# Altium project PCB_Project1.PrjPCB
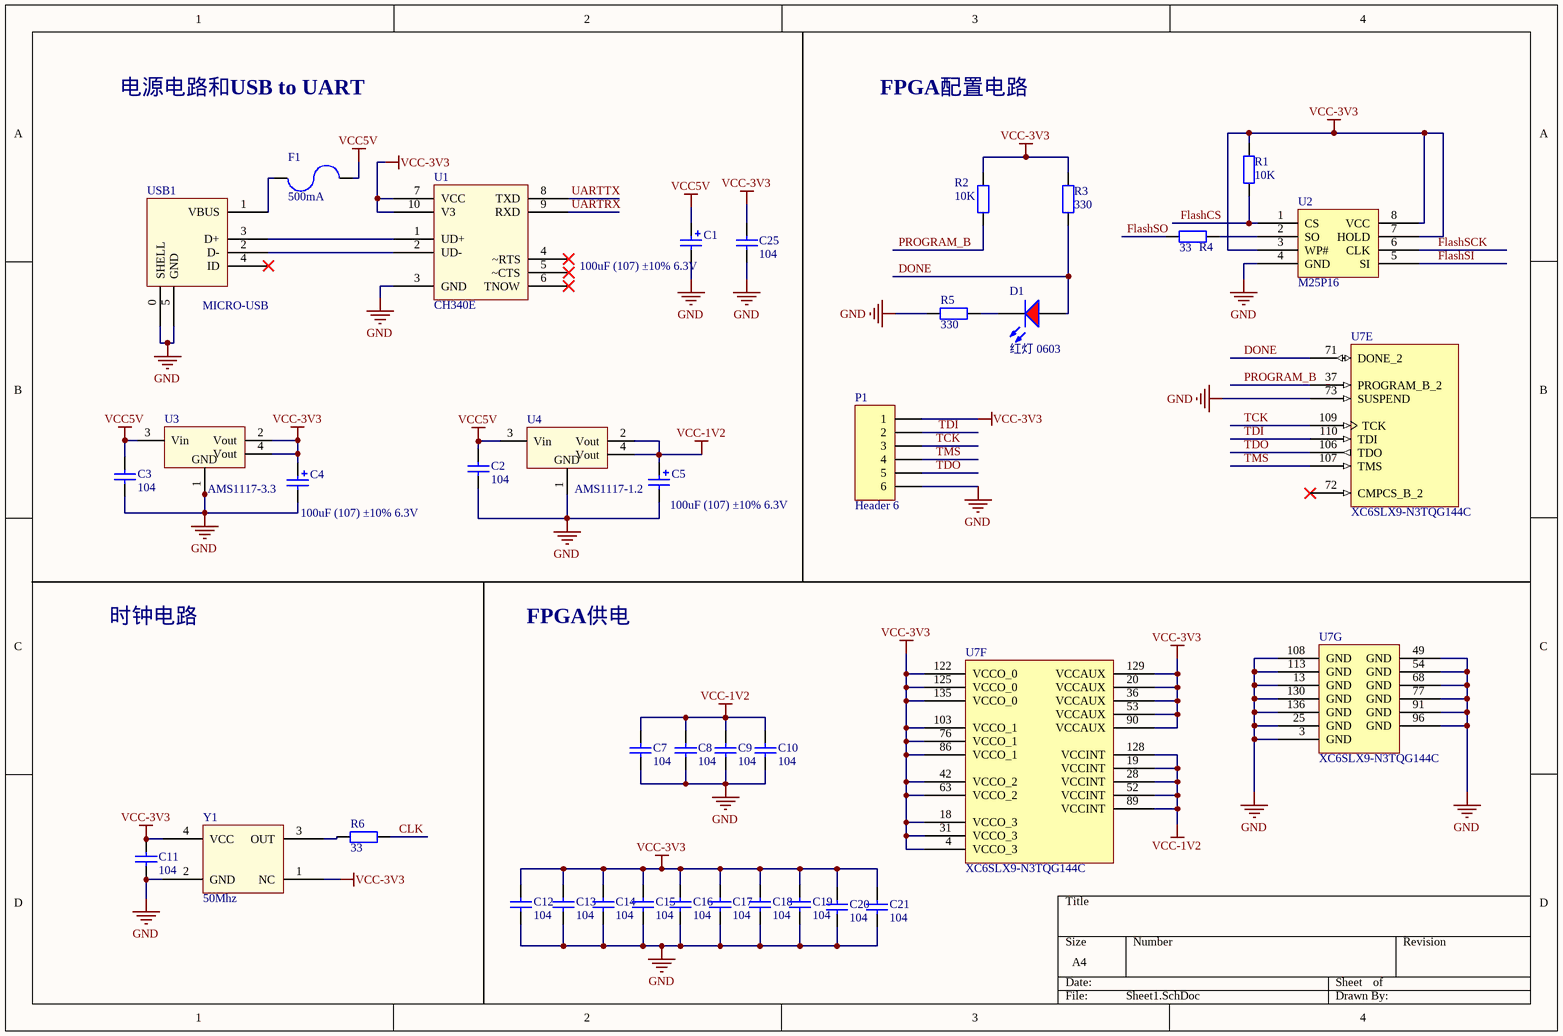
[diagram p0: Sheet1.SchDoc]
3 sheets, 53 parts. Net scope: global (net labels, ports and power ports of the same name join across sheets).
Board file: PCB1.PcbDoc
Sheets:
  Sheet1.SchDoc
  Sheet2.SchDoc
  Sheet4.SchDoc

## Sheet Sheet1.SchDoc
size A4

### Parts
C1  100uF (107) ±10% 6.3V  [CASE-B_3528]
C2  104  [0603_C]
C3  104  [0603_C]
C4  100uF (107) ±10% 6.3V  [CASE-B_3528]
C5  100uF (107) ±10% 6.3V  [CASE-B_3528]
C7  104  [0603_C]
C8  104  [0603_C]
C9  104  [0603_C]
C10  104  [0603_C]
C11  104  [0603_C]
C12  104  [0603_C]
C13  104  [0603_C]
C14  104  [0603_C]
C15  104  [0603_C]
C16  104  [0603_C]
C17  104  [0603_C]
C18  104  [0603_C]
C19  104  [0603_C]
C20  104  [0603_C]
C21  104  [0603_C]
C25  104  [0603_C]
D1  红灯 0603  [0603_LED_S1]
F1  500mA  [PTC[0805]]
P1  Header 6  [HDR1X6]
R1  10K  [0603_R]
R2  10K  [0603_R]
R3  330  [0603_R]
R4  33  [0603_R]
R5  330  [0603_R]
R6  33  [0603_R]
U1  CH340E  [MSOP10]
U2  M25P16  [SO-8]
U3  AMS1117-3.3  [SOT-223(AMS1117-3.3)]
U4  AMS1117-1.2  [SOT-223(AMS1117-3.3)]
U7  XC6SLX9-N3TQG144C  [TQG144_N]  (parts E,F,G of 7)
USB1  MICRO-USB  [MICRO-USB]
Y1  50Mhz  [XTAL5032]

### Nets
GND: C1.2 C2.1 C3.1 C4.2 C5.2 C7.1 C8.1 C9.1 C10.1 C11.1 C12.1 C13.1 C14.1 C15.1 C16.1 C17.1 C18.1 C19.1 C20.1 C21.1 C25.1 P1.6 R5.2 U1.3(GND) U2.4(GND) U3.1(GND) U4.1(GND) U7.3(GND) U7.13(GND) U7.25(GND) U7.49(GND) U7.54(GND) U7.68(GND) U7.73(SUSPEND) U7.77(GND) U7.91(GND) U7.96(GND) U7.108(GND) U7.113(GND) U7.130(GND) U7.136(GND) USB1.0(SHELL) USB1.5(GND) Y1.2(GND)
VCC5V: C1.1 C2.2 C3.2 F1.1 U3.3(Vin) U4.3(Vin)
VCC-1V2: C5.1 C7.2 C8.2 C9.2 C10.2 U4.2(Vout) U4.4(Vout) U7.19(VCCINT) U7.28(VCCINT) U7.52(VCCINT) U7.89(VCCINT) U7.128(VCCINT)
VCC-3V3: C4.1 C11.2 C12.2 C13.2 C14.2 C15.2 C16.2 C17.2 C18.2 C19.2 C20.2 C21.2 C25.2 P1.1 R1.2 R2.2 R3.2 U1.7(VCC) U1.10(V3) U2.3(WP#) U2.7(HOLD) U2.8(VCC) U3.2(Vout) U3.4(Vout) U7.4(VCCO_3) U7.18(VCCO_3) U7.20(VCCAUX) U7.31(VCCO_3) U7.36(VCCAUX) U7.42(VCCO_2) U7.53(VCCAUX) U7.63(VCCO_2) U7.76(VCCO_1) U7.86(VCCO_1) U7.90(VCCAUX) U7.103(VCCO_1) U7.122(VCCO_0) U7.125(VCCO_0) U7.129(VCCAUX) U7.135(VCCO_0) Y1.1(NC) Y1.4(VCC)
CLK: R6.1
DONE: D1.A R3.1 U7.71(DONE_2)
FlashCS: R1.1 U2.1(CS)
FlashSCK: U2.6(CLK)
FlashSI: U2.5(SI)
FlashSO: R4.2
PROGRAM_B: R2.1 U7.37(PROGRAM_B_2)
TCK: P1.3 U7.109(TCK)
TDI: P1.2 U7.110(TDI)
TDO: P1.5 U7.106(TDO)
TMS: P1.4 U7.107(TMS)
UARTRX: U1.9(RXD)
UARTTX: U1.8(TXD)
NetD1_K: D1.K R5.1
NetF1_2: F1.2 USB1.1(VBUS)
NetR4_1: R4.1 U2.2(SO)
NetR6_2: R6.2 Y1.3(OUT)
NetU1_1: U1.1(UD+) USB1.3(D+)
NetU1_2: U1.2(UD-) USB1.2(D-)

Not connected (* = marked no-connect by the designer): U1 4(~RTS)* 5(~CTS)* 6(TNOW)*; U7 72(CMPCS_B_2)*; USB1 4(ID)*

### Notes on the sheet
- 电源电路和USB to UART
- FPGA配置电路
- 时钟电路
- FPGA供电

### Library data of the parts
C1 C4 C5 = 3528 100uF (107) 10% 6.3V: 钽电容; ComponentLink1Description: 供应商链接; ComponentLink1URL: http://www.szlcsc.com/product/details_16815.html; Package: 3528; Supplier: LC; SuppliersPartNumber: C16133
C2 C3 C7-C21 C25 = 0603 30pF (300) 5% 50V: 贴片电容; ComponentLink1Description: 供应商链接; ComponentLink1URL: http://www.szlcsc.com/product/details_23122.html; Package: 0603; Supplier: LC; SuppliersPartNumber: C22397
D1 = 0603 红灯: 发光二极管; ComponentLink1Description: 供应商链接; ComponentLink1URL: http://www.szlcsc.com/product/details_2659.html; Package: 0603; Supplier: LC; SuppliersPartNumber: C2286
F1 = PTC
P1 = Header 6: Header, 6-Pin; LatestRevisionDate: 17-Jul-2002; LatestRevisionNote: Re-released for DXP Platform.; Publisher: Altium Limited
R1-R6 = 0603 9.1KΩ (9101) 1%: 贴片电阻; ComponentLink1Description: 供应商链接; ComponentLink1URL: http://www.szlcsc.com/product/details_23987.html; Package: 0603; Supplier: LC; SuppliersPartNumber: C23260
U2 = W25Q64
U4 = AMS1117-3.3
U7 = XC6SLX9-N3TQG144C: Spartan-6 LX 1.2V FPGA, 102 User I/Os, 144-Pin TQFP (0.5mm Pitch), Speed Grade 3N, Commercial Grade, Pb-Free; Published: 24-Aug-2010; DatasheetVersion: ver1.6, Nov-2010; PackageVersion: ver1.2, Jun-2004; PackageReference: TQG144; Publisher: Altium Limited; PackageDescription: 144-Pin Thin Quad Flat Pack (TQG144) - Pb-Free; Code_JEDEC: MS-026-BFB; ComponentLink1Description: Manufacturer Link; ComponentLink1URL: http://www.xilinx.com; ComponentLink2Description: Spartan-6 Datasheet; ComponentLink2URL: http://www.xilinx.com/support/documentation/data_sheets/ds160.pdf; ComponentLink3Description: Spartan-6 Documents; ComponentLink3URL: http://www.xilinx.com/support/documentation/spartan-6.htm; ComponentLink4Description: Xilinx.com Home; ComponentLink4URL: http://www.xilinx.com
Y1 = 有源晶振

## Sheet Sheet2.SchDoc
size A4
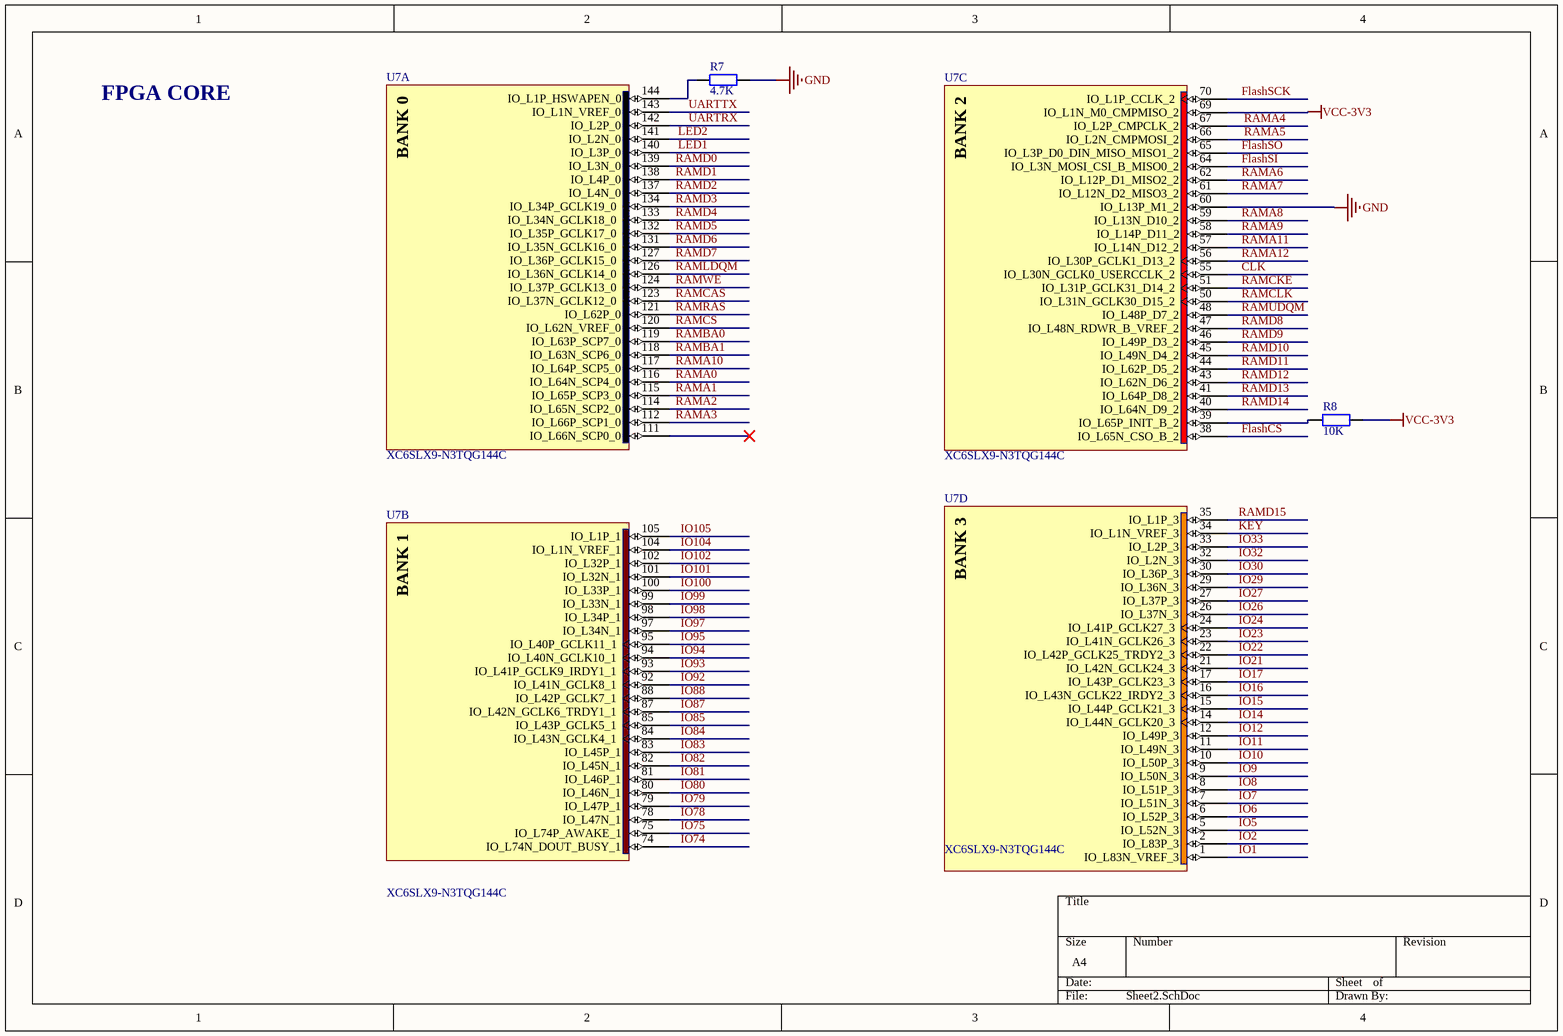
[diagram p1: Sheet2.SchDoc]

### Parts
R7  4.7K  [0603_R]
R8  10K  [0603_R]
U7  XC6SLX9-N3TQG144C  [TQG144_N]  (parts A,B,C,D of 7)

### Nets
GND: R7.2 U7.60(IO_L13P_M1_2)
VCC-3V3: R8.1 U7.69(IO_L1N_M0_CMPMISO_2)
CLK: U7.55(IO_L30N_GCLK0_USERCCLK_2)
FlashCS: U7.38(IO_L65N_CSO_B_2)
FlashSCK: U7.70(IO_L1P_CCLK_2)
FlashSI: U7.64(IO_L3N_MOSI_CSI_B_MISO0_2)
FlashSO: U7.65(IO_L3P_D0_DIN_MISO_MISO1_2)
IO1: U7.1(IO_L83N_VREF_3)
IO2: U7.2(IO_L83P_3)
IO5: U7.5(IO_L52N_3)
IO6: U7.6(IO_L52P_3)
IO7: U7.7(IO_L51N_3)
IO8: U7.8(IO_L51P_3)
IO9: U7.9(IO_L50N_3)
IO10: U7.10(IO_L50P_3)
IO11: U7.11(IO_L49N_3)
IO12: U7.12(IO_L49P_3)
IO14: U7.14(IO_L44N_GCLK20_3)
IO15: U7.15(IO_L44P_GCLK21_3)
IO16: U7.16(IO_L43N_GCLK22_IRDY2_3)
IO17: U7.17(IO_L43P_GCLK23_3)
IO21: U7.21(IO_L42N_GCLK24_3)
IO22: U7.22(IO_L42P_GCLK25_TRDY2_3)
IO23: U7.23(IO_L41N_GCLK26_3)
IO24: U7.24(IO_L41P_GCLK27_3)
IO26: U7.26(IO_L37N_3)
IO27: U7.27(IO_L37P_3)
IO29: U7.29(IO_L36N_3)
IO30: U7.30(IO_L36P_3)
IO32: U7.32(IO_L2N_3)
IO33: U7.33(IO_L2P_3)
IO74: U7.74(IO_L74N_DOUT_BUSY_1)
IO75: U7.75(IO_L74P_AWAKE_1)
IO78: U7.78(IO_L47N_1)
IO79: U7.79(IO_L47P_1)
IO80: U7.80(IO_L46N_1)
IO81: U7.81(IO_L46P_1)
IO82: U7.82(IO_L45N_1)
IO83: U7.83(IO_L45P_1)
IO84: U7.84(IO_L43N_GCLK4_1)
IO85: U7.85(IO_L43P_GCLK5_1)
IO87: U7.87(IO_L42N_GCLK6_TRDY1_1)
IO88: U7.88(IO_L42P_GCLK7_1)
IO92: U7.92(IO_L41N_GCLK8_1)
IO93: U7.93(IO_L41P_GCLK9_IRDY1_1)
IO94: U7.94(IO_L40N_GCLK10_1)
IO95: U7.95(IO_L40P_GCLK11_1)
IO97: U7.97(IO_L34N_1)
IO98: U7.98(IO_L34P_1)
IO99: U7.99(IO_L33N_1)
IO100: U7.100(IO_L33P_1)
IO101: U7.101(IO_L32N_1)
IO102: U7.102(IO_L32P_1)
IO104: U7.104(IO_L1N_VREF_1)
IO105: U7.105(IO_L1P_1)
KEY: U7.34(IO_L1N_VREF_3)
LED1: U7.140(IO_L3P_0)
LED2: U7.141(IO_L2N_0)
RAMA0: U7.116(IO_L64N_SCP4_0)
RAMA1: U7.115(IO_L65P_SCP3_0)
RAMA2: U7.114(IO_L65N_SCP2_0)
RAMA3: U7.112(IO_L66P_SCP1_0)
RAMA4: U7.67(IO_L2P_CMPCLK_2)
RAMA5: U7.66(IO_L2N_CMPMOSI_2)
RAMA6: U7.62(IO_L12P_D1_MISO2_2)
RAMA7: U7.61(IO_L12N_D2_MISO3_2)
RAMA8: U7.59(IO_L13N_D10_2)
RAMA9: U7.58(IO_L14P_D11_2)
RAMA10: U7.117(IO_L64P_SCP5_0)
RAMA11: U7.57(IO_L14N_D12_2)
RAMA12: U7.56(IO_L30P_GCLK1_D13_2)
RAMBA0: U7.119(IO_L63P_SCP7_0)
RAMBA1: U7.118(IO_L63N_SCP6_0)
RAMCAS: U7.123(IO_L37N_GCLK12_0)
RAMCKE: U7.51(IO_L31P_GCLK31_D14_2)
RAMCLK: U7.50(IO_L31N_GCLK30_D15_2)
RAMCS: U7.120(IO_L62N_VREF_0)
RAMD0: U7.139(IO_L3N_0)
RAMD1: U7.138(IO_L4P_0)
RAMD2: U7.137(IO_L4N_0)
RAMD3: U7.134(IO_L34P_GCLK19_0)
RAMD4: U7.133(IO_L34N_GCLK18_0)
RAMD5: U7.132(IO_L35P_GCLK17_0)
RAMD6: U7.131(IO_L35N_GCLK16_0)
RAMD7: U7.127(IO_L36P_GCLK15_0)
RAMD8: U7.47(IO_L48N_RDWR_B_VREF_2)
RAMD9: U7.46(IO_L49P_D3_2)
RAMD10: U7.45(IO_L49N_D4_2)
RAMD11: U7.44(IO_L62P_D5_2)
RAMD12: U7.43(IO_L62N_D6_2)
RAMD13: U7.41(IO_L64P_D8_2)
RAMD14: U7.40(IO_L64N_D9_2)
RAMD15: U7.35(IO_L1P_3)
RAMLDQM: U7.126(IO_L36N_GCLK14_0)
RAMRAS: U7.121(IO_L62P_0)
RAMUDQM: U7.48(IO_L48P_D7_2)
RAMWE: U7.124(IO_L37P_GCLK13_0)
UARTRX: U7.142(IO_L2P_0)
UARTTX: U7.143(IO_L1N_VREF_0)
NetR7_1: R7.1 U7.144(IO_L1P_HSWAPEN_0)
NetR8_2: R8.2 U7.39(IO_L65P_INIT_B_2)

Not connected (* = marked no-connect by the designer): U7 111(IO_L66N_SCP0_0)*

### Notes on the sheet
- FPGA CORE
- (in symbol XC6SLX9-N3TQG144C, part A) BANK 0
- (in symbol XC6SLX9-N3TQG144C, part B) BANK 1
- (in symbol XC6SLX9-N3TQG144C, part C) BANK 2
- (in symbol XC6SLX9-N3TQG144C, part D) BANK 3

### Library data of the parts
R7 R8 = 0603 9.1KΩ (9101) 1%: 贴片电阻; ComponentLink1Description: 供应商链接; ComponentLink1URL: http://www.szlcsc.com/product/details_23987.html; Package: 0603; Supplier: LC; SuppliersPartNumber: C23260
U7 = XC6SLX9-N3TQG144C: as U7 on sheet Sheet1; Published: 24-Aug-2010; DatasheetVersion: ver1.6, Nov-2010; PackageVersion: ver1.2, Jun-2004; PackageReference: TQG144; Publisher: Altium Limited; PackageDescription: 144-Pin Thin Quad Flat Pack (TQG144) - Pb-Free; Code_JEDEC: MS-026-BFB; ComponentLink1Description: Manufacturer Link; ComponentLink1URL: http://www.xilinx.com; ComponentLink2Description: Spartan-6 Datasheet; ComponentLink2URL: http://www.xilinx.com/support/documentation/data_sheets/ds160.pdf; ComponentLink3Description: Spartan-6 Documents; ComponentLink3URL: http://www.xilinx.com/support/documentation/spartan-6.htm; ComponentLink4Description: Xilinx.com Home; ComponentLink4URL: http://www.xilinx.com

## Sheet Sheet4.SchDoc
size A4
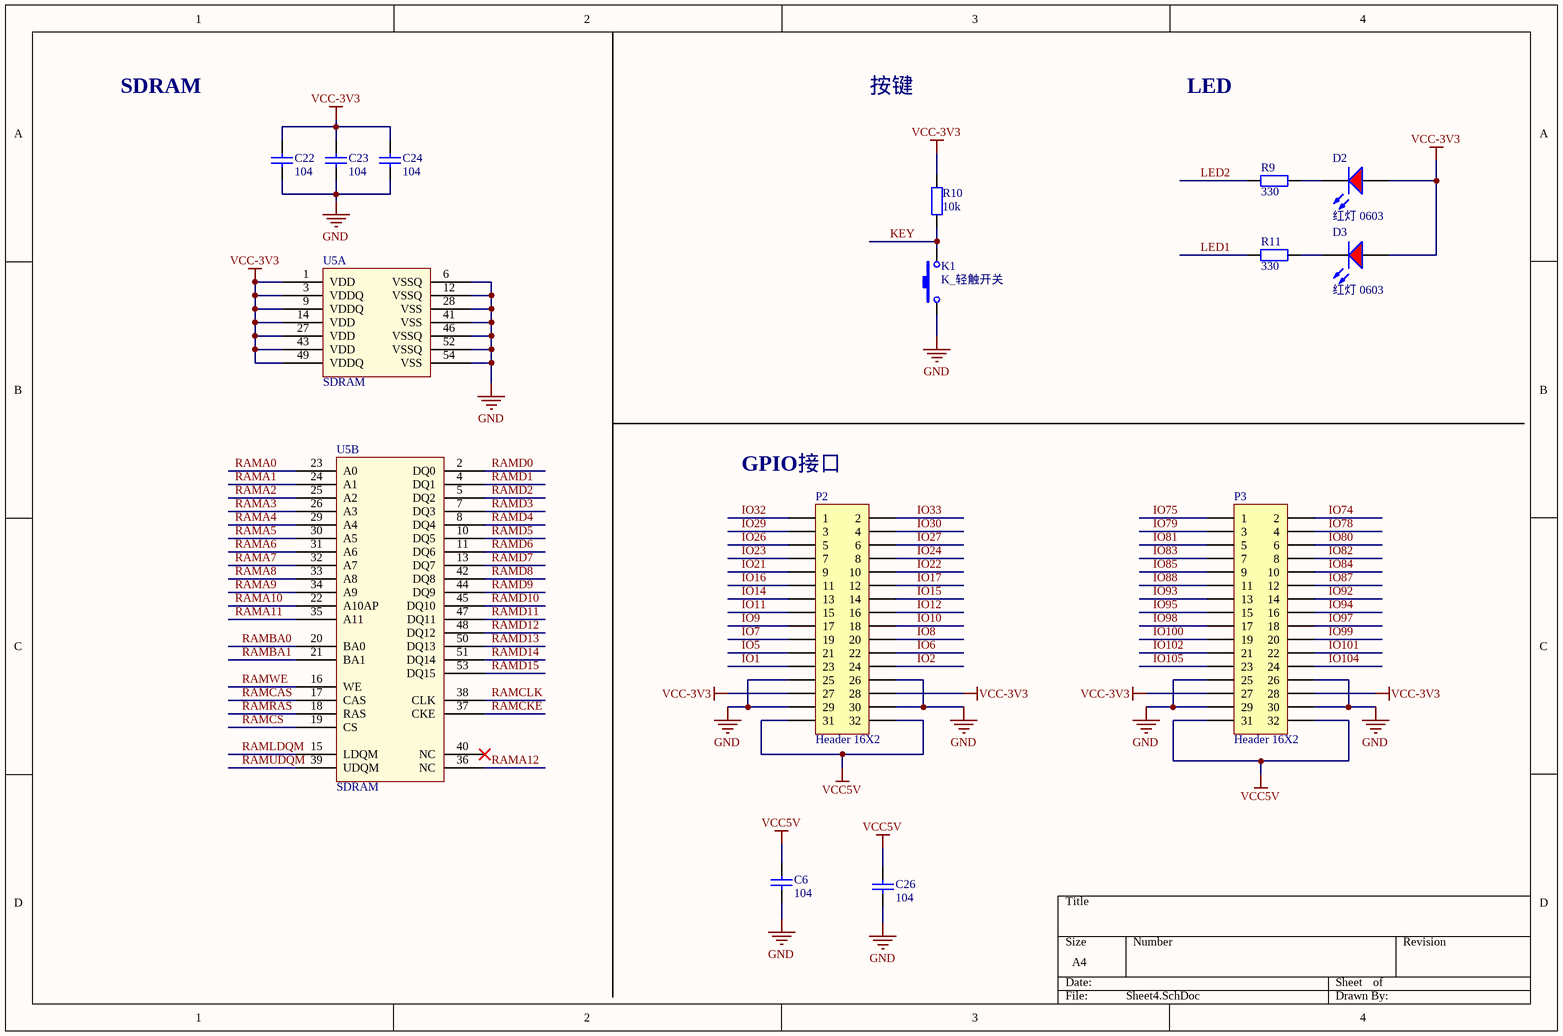
[diagram p2: Sheet4.SchDoc]

### Parts
C6  104  [0603_C]
C22  104  [0603_C]
C23  104  [0603_C]
C24  104  [0603_C]
C26  104  [0603_C]
D2  红灯 0603  [0603_LED_S1]
D3  红灯 0603  [0603_LED_S1]
K1  K_轻触开关  [KEY]
P2  Header 16X2  [HDR2X16]
P3  Header 16X2  [HDR2X16]
R9  330  [0603_R]
R10  10k  [0603_R]
R11  330  [0603_R]
U5  SDRAM  [SDRAM]  (parts A,B of 2)

### Nets
GND: C6.1 C22.1 C23.1 C24.1 C26.1 K1.1 P2.25 P2.26 P2.29 P2.30 P3.25 P3.26 P3.29 P3.30 U5.6(VSSQ) U5.12(VSSQ) U5.28(VSS) U5.41(VSS) U5.46(VSSQ) U5.52(VSSQ) U5.54(VSS)
VCC5V: C6.2 C26.2 P2.31 P2.32 P3.31 P3.32
VCC-3V3: C22.2 C23.2 C24.2 D2.A D3.A P2.27 P2.28 P3.27 P3.28 R10.1 U5.1(VDD) U5.3(VDDQ) U5.9(VDDQ) U5.14(VDD) U5.27(VDD) U5.43(VDD) U5.49(VDDQ)
IO1: P2.23
IO2: P2.24
IO5: P2.21
IO6: P2.22
IO7: P2.19
IO8: P2.20
IO9: P2.17
IO10: P2.18
IO11: P2.15
IO12: P2.16
IO14: P2.13
IO15: P2.14
IO16: P2.11
IO17: P2.12
IO21: P2.9
IO22: P2.10
IO23: P2.7
IO24: P2.8
IO26: P2.5
IO27: P2.6
IO29: P2.3
IO30: P2.4
IO32: P2.1
IO33: P2.2
IO74: P3.2
IO75: P3.1
IO78: P3.4
IO79: P3.3
IO80: P3.6
IO81: P3.5
IO82: P3.8
IO83: P3.7
IO84: P3.10
IO85: P3.9
IO87: P3.12
IO88: P3.11
IO92: P3.14
IO93: P3.13
IO94: P3.16
IO95: P3.15
IO97: P3.18
IO98: P3.17
IO99: P3.20
IO100: P3.19
IO101: P3.22
IO102: P3.21
IO104: P3.24
IO105: P3.23
KEY: K1.2 R10.2
LED1: R11.2
LED2: R9.2
RAMA0: U5.23(A0)
RAMA1: U5.24(A1)
RAMA2: U5.25(A2)
RAMA3: U5.26(A3)
RAMA4: U5.29(A4)
RAMA5: U5.30(A5)
RAMA6: U5.31(A6)
RAMA7: U5.32(A7)
RAMA8: U5.33(A8)
RAMA9: U5.34(A9)
RAMA10: U5.22(A10AP)
RAMA11: U5.35(A11)
RAMA12: U5.36(NC)
RAMBA0: U5.20(BA0)
RAMBA1: U5.21(BA1)
RAMCAS: U5.17(CAS)
RAMCKE: U5.37(CKE)
RAMCLK: U5.38(CLK)
RAMCS: U5.19(CS)
RAMD0: U5.2(DQ0)
RAMD1: U5.4(DQ1)
RAMD2: U5.5(DQ2)
RAMD3: U5.7(DQ3)
RAMD4: U5.8(DQ4)
RAMD5: U5.10(DQ5)
RAMD6: U5.11(DQ6)
RAMD7: U5.13(DQ7)
RAMD8: U5.42(DQ8)
RAMD9: U5.44(DQ9)
RAMD10: U5.45(DQ10)
RAMD11: U5.47(DQ11)
RAMD12: U5.48(DQ12)
RAMD13: U5.50(DQ13)
RAMD14: U5.51(DQ14)
RAMD15: U5.53(DQ15)
RAMLDQM: U5.15(LDQM)
RAMRAS: U5.18(RAS)
RAMUDQM: U5.39(UDQM)
RAMWE: U5.16(WE)
NetD2_K: D2.K R9.1
NetD3_K: D3.K R11.1

Not connected (* = marked no-connect by the designer): U5 40(NC)*

### Notes on the sheet
- SDRAM
- 按键
- LED
- (near P2) GPIO接口

### Library data of the parts
C6 C22-C24 C26 = 0603 30pF (300) 5% 50V: 贴片电容; ComponentLink1Description: 供应商链接; ComponentLink1URL: http://www.szlcsc.com/product/details_23122.html; Package: 0603; Supplier: LC; SuppliersPartNumber: C22397
D2 D3 = 0603 红灯: 发光二极管; ComponentLink1Description: 供应商链接; ComponentLink1URL: http://www.szlcsc.com/product/details_2659.html; Package: 0603; Supplier: LC; SuppliersPartNumber: C2286
P2 P3 = Header 16X2: Header, 16-Pin, Dual row; LatestRevisionDate: 17-Jul-2002; LatestRevisionNote: Re-released for DXP Platform.; Publisher: Altium Limited
R9-R11 = 0603 9.1KΩ (9101) 1%: 贴片电阻; ComponentLink1Description: 供应商链接; ComponentLink1URL: http://www.szlcsc.com/product/details_23987.html; Package: 0603; Supplier: LC; SuppliersPartNumber: C23260

## Nets that join several sheets
GND: Sheet1 (44 pins), Sheet2 (R7.2 U7.60), Sheet4 (21 pins)
VCC5V: Sheet1 (6 pins), Sheet4 (6 pins)
VCC-3V3: Sheet1 (42 pins), Sheet2 (R8.1 U7.69), Sheet4 (17 pins)
CLK: Sheet1 (R6.1), Sheet2 (U7.55)
FlashCS: Sheet1 (R1.1 U2.1), Sheet2 (U7.38)
FlashSCK: Sheet1 (U2.6), Sheet2 (U7.70)
FlashSI: Sheet1 (U2.5), Sheet2 (U7.64)
FlashSO: Sheet1 (R4.2), Sheet2 (U7.65)
IO1: Sheet2 (U7.1), Sheet4 (P2.23)
IO2: Sheet2 (U7.2), Sheet4 (P2.24)
IO5: Sheet2 (U7.5), Sheet4 (P2.21)
IO6: Sheet2 (U7.6), Sheet4 (P2.22)
IO7: Sheet2 (U7.7), Sheet4 (P2.19)
IO8: Sheet2 (U7.8), Sheet4 (P2.20)
IO9: Sheet2 (U7.9), Sheet4 (P2.17)
IO10: Sheet2 (U7.10), Sheet4 (P2.18)
IO11: Sheet2 (U7.11), Sheet4 (P2.15)
IO12: Sheet2 (U7.12), Sheet4 (P2.16)
IO14: Sheet2 (U7.14), Sheet4 (P2.13)
IO15: Sheet2 (U7.15), Sheet4 (P2.14)
IO16: Sheet2 (U7.16), Sheet4 (P2.11)
IO17: Sheet2 (U7.17), Sheet4 (P2.12)
IO21: Sheet2 (U7.21), Sheet4 (P2.9)
IO22: Sheet2 (U7.22), Sheet4 (P2.10)
IO23: Sheet2 (U7.23), Sheet4 (P2.7)
IO24: Sheet2 (U7.24), Sheet4 (P2.8)
IO26: Sheet2 (U7.26), Sheet4 (P2.5)
IO27: Sheet2 (U7.27), Sheet4 (P2.6)
IO29: Sheet2 (U7.29), Sheet4 (P2.3)
IO30: Sheet2 (U7.30), Sheet4 (P2.4)
IO32: Sheet2 (U7.32), Sheet4 (P2.1)
IO33: Sheet2 (U7.33), Sheet4 (P2.2)
IO74: Sheet2 (U7.74), Sheet4 (P3.2)
IO75: Sheet2 (U7.75), Sheet4 (P3.1)
IO78: Sheet2 (U7.78), Sheet4 (P3.4)
IO79: Sheet2 (U7.79), Sheet4 (P3.3)
IO80: Sheet2 (U7.80), Sheet4 (P3.6)
IO81: Sheet2 (U7.81), Sheet4 (P3.5)
IO82: Sheet2 (U7.82), Sheet4 (P3.8)
IO83: Sheet2 (U7.83), Sheet4 (P3.7)
IO84: Sheet2 (U7.84), Sheet4 (P3.10)
IO85: Sheet2 (U7.85), Sheet4 (P3.9)
IO87: Sheet2 (U7.87), Sheet4 (P3.12)
IO88: Sheet2 (U7.88), Sheet4 (P3.11)
IO92: Sheet2 (U7.92), Sheet4 (P3.14)
IO93: Sheet2 (U7.93), Sheet4 (P3.13)
IO94: Sheet2 (U7.94), Sheet4 (P3.16)
IO95: Sheet2 (U7.95), Sheet4 (P3.15)
IO97: Sheet2 (U7.97), Sheet4 (P3.18)
IO98: Sheet2 (U7.98), Sheet4 (P3.17)
IO99: Sheet2 (U7.99), Sheet4 (P3.20)
IO100: Sheet2 (U7.100), Sheet4 (P3.19)
IO101: Sheet2 (U7.101), Sheet4 (P3.22)
IO102: Sheet2 (U7.102), Sheet4 (P3.21)
IO104: Sheet2 (U7.104), Sheet4 (P3.24)
IO105: Sheet2 (U7.105), Sheet4 (P3.23)
KEY: Sheet2 (U7.34), Sheet4 (K1.2 R10.2)
LED1: Sheet2 (U7.140), Sheet4 (R11.2)
LED2: Sheet2 (U7.141), Sheet4 (R9.2)
RAMA0: Sheet2 (U7.116), Sheet4 (U5.23)
RAMA1: Sheet2 (U7.115), Sheet4 (U5.24)
RAMA2: Sheet2 (U7.114), Sheet4 (U5.25)
RAMA3: Sheet2 (U7.112), Sheet4 (U5.26)
RAMA4: Sheet2 (U7.67), Sheet4 (U5.29)
RAMA5: Sheet2 (U7.66), Sheet4 (U5.30)
RAMA6: Sheet2 (U7.62), Sheet4 (U5.31)
RAMA7: Sheet2 (U7.61), Sheet4 (U5.32)
RAMA8: Sheet2 (U7.59), Sheet4 (U5.33)
RAMA9: Sheet2 (U7.58), Sheet4 (U5.34)
RAMA10: Sheet2 (U7.117), Sheet4 (U5.22)
RAMA11: Sheet2 (U7.57), Sheet4 (U5.35)
RAMA12: Sheet2 (U7.56), Sheet4 (U5.36)
RAMBA0: Sheet2 (U7.119), Sheet4 (U5.20)
RAMBA1: Sheet2 (U7.118), Sheet4 (U5.21)
RAMCAS: Sheet2 (U7.123), Sheet4 (U5.17)
RAMCKE: Sheet2 (U7.51), Sheet4 (U5.37)
RAMCLK: Sheet2 (U7.50), Sheet4 (U5.38)
RAMCS: Sheet2 (U7.120), Sheet4 (U5.19)
RAMD0: Sheet2 (U7.139), Sheet4 (U5.2)
RAMD1: Sheet2 (U7.138), Sheet4 (U5.4)
RAMD2: Sheet2 (U7.137), Sheet4 (U5.5)
RAMD3: Sheet2 (U7.134), Sheet4 (U5.7)
RAMD4: Sheet2 (U7.133), Sheet4 (U5.8)
RAMD5: Sheet2 (U7.132), Sheet4 (U5.10)
RAMD6: Sheet2 (U7.131), Sheet4 (U5.11)
RAMD7: Sheet2 (U7.127), Sheet4 (U5.13)
RAMD8: Sheet2 (U7.47), Sheet4 (U5.42)
RAMD9: Sheet2 (U7.46), Sheet4 (U5.44)
RAMD10: Sheet2 (U7.45), Sheet4 (U5.45)
RAMD11: Sheet2 (U7.44), Sheet4 (U5.47)
RAMD12: Sheet2 (U7.43), Sheet4 (U5.48)
RAMD13: Sheet2 (U7.41), Sheet4 (U5.50)
RAMD14: Sheet2 (U7.40), Sheet4 (U5.51)
RAMD15: Sheet2 (U7.35), Sheet4 (U5.53)
RAMLDQM: Sheet2 (U7.126), Sheet4 (U5.15)
RAMRAS: Sheet2 (U7.121), Sheet4 (U5.18)
RAMUDQM: Sheet2 (U7.48), Sheet4 (U5.39)
RAMWE: Sheet2 (U7.124), Sheet4 (U5.16)
UARTRX: Sheet1 (U1.9), Sheet2 (U7.142)
UARTTX: Sheet1 (U1.8), Sheet2 (U7.143)